# Altium schematic sheet LPSP_BlockDiagram.SchDoc
size A3; Organization: Canis Tech; Address1: -; Address2: -; Address3: -; Address4: Indaiatuba/SP; Address5: Brazil
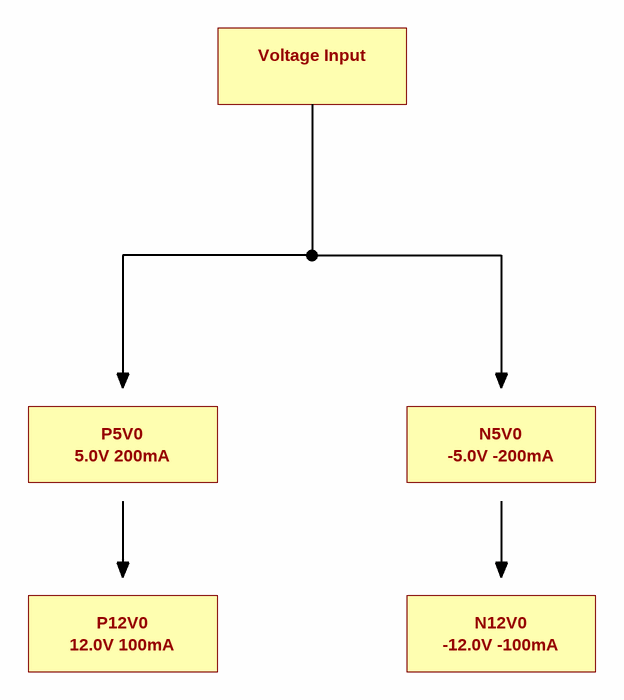
[diagram p0: LPSP_BlockDiagram.SchDoc]

## Notes on the sheet
- Voltage Input
- P5V0
- 5.0V 200mA
- N5V0
- -5.0V -200mA
- P12V0
- 12.0V 100mA
- N12V0
- -12.0V -100mA
- Title
- Author
- Checked By
- Variant
- Size:
- Revision:
- A3
- Date:
- Project
- Time:
- Sheet
- of
- File: